# EAGLE design control-surface-left (EAGLE 6.6.0)
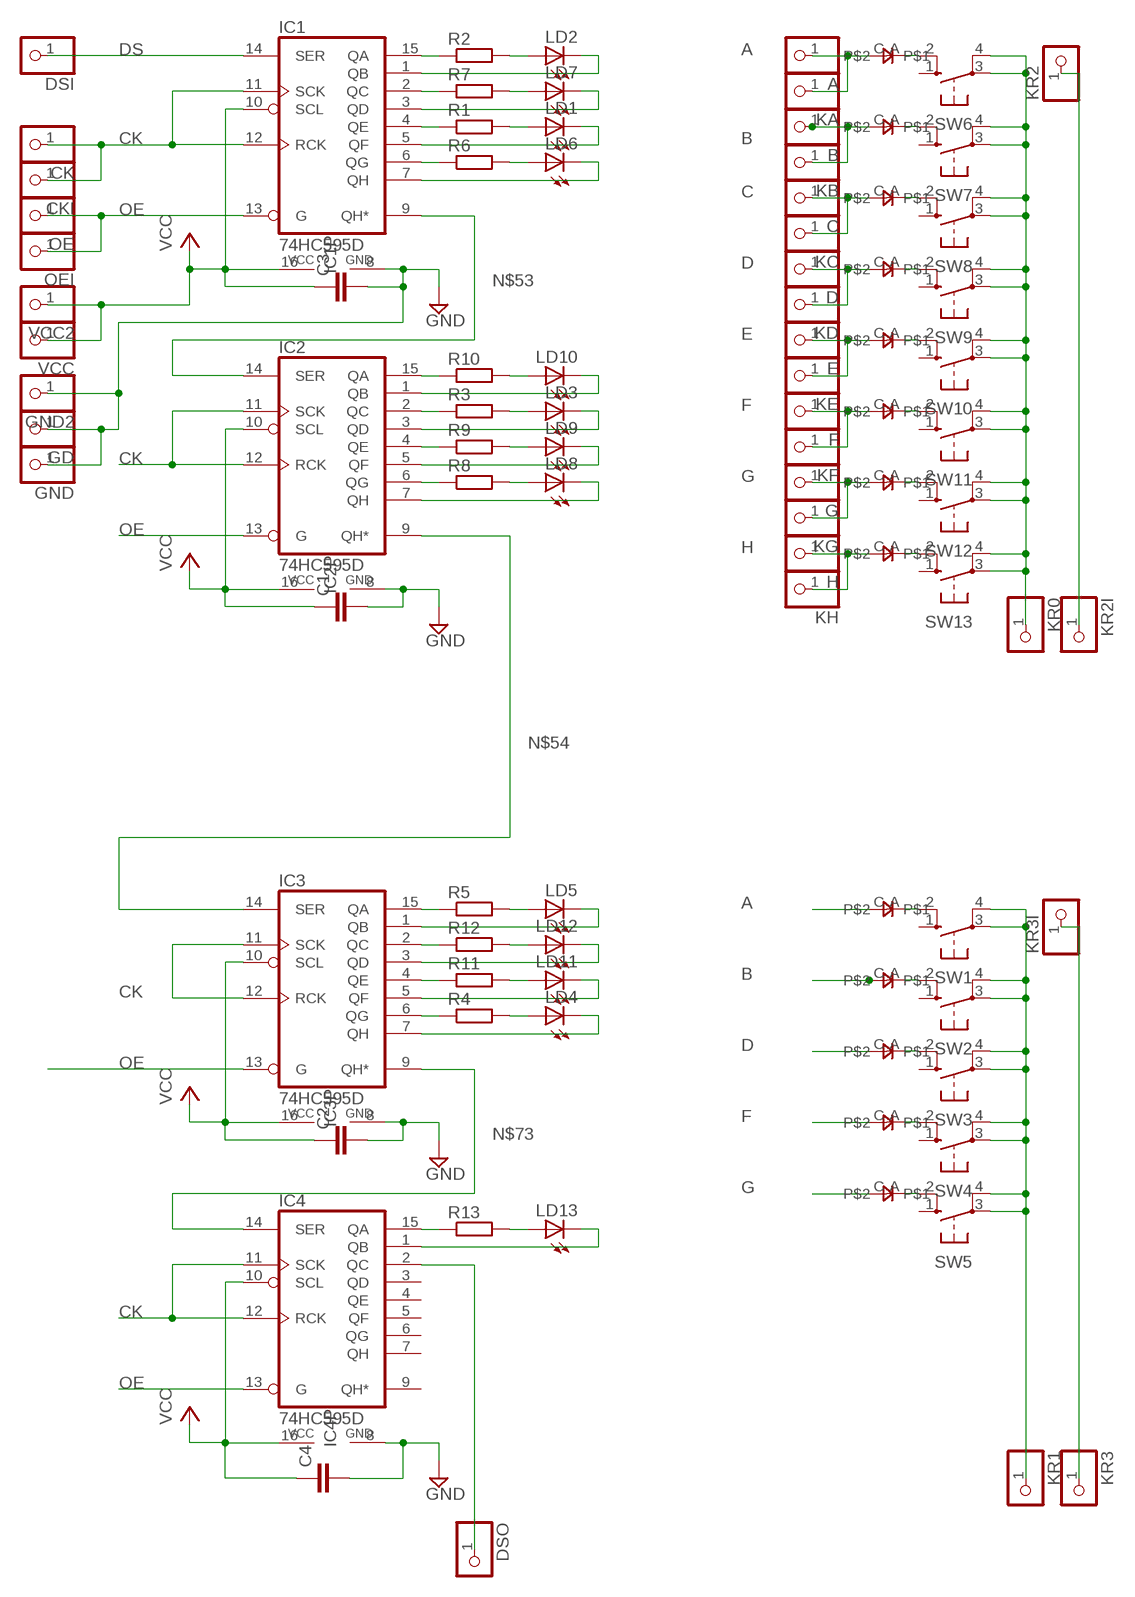
[diagram p0: schematic, sheet 1]

## Parts
A  PINHD-1X1  [1X01]
B  PINHD-1X1  [1X01]
C  PINHD-1X1  [1X01]
C1  C-EUC0805  [C0805]
C2  C-EUC0805  [C0805]
C3  C-EUC0805  [C0805]
C4  C-EUC0805  [C0805]
CK  PINHD-1X1  [1X01]
CKI  PINHD-1X1  [1X01]
D  PINHD-1X1  [1X01]
D1  0805DIODE  [0805DIODE]
D2  0805DIODE  [0805DIODE]
D3  0805DIODE  [0805DIODE]
D4  0805DIODE  [0805DIODE]
D5  0805DIODE  [0805DIODE]
D6  0805DIODE  [0805DIODE]
D7  0805DIODE  [0805DIODE]
D8  0805DIODE  [0805DIODE]
D9  0805DIODE  [0805DIODE]
D10  0805DIODE  [0805DIODE]
D11  0805DIODE  [0805DIODE]
D12  0805DIODE  [0805DIODE]
D13  0805DIODE  [0805DIODE]
DSI  PINHD-1X1  [1X01]
DSO  PINHD-1X1  [1X01]
E  PINHD-1X1  [1X01]
F  PINHD-1X1  [1X01]
G  PINHD-1X1  [1X01]
GD  PINHD-1X1  [1X01]
GND  PINHD-1X1  [1X01]
GND2  PINHD-1X1  [1X01]
H  PINHD-1X1  [1X01]
IC1  74HC595D  [SO16]
IC2  74HC595D  [SO16]
IC3  74HC595D  [SO16]
IC4  74HC595D  [SO16]
KA  PINHD-1X1  [1X01]
KB  PINHD-1X1  [1X01]
KC  PINHD-1X1  [1X01]
KD  PINHD-1X1  [1X01]
KE  PINHD-1X1  [1X01]
KF  PINHD-1X1  [1X01]
KG  PINHD-1X1  [1X01]
KH  PINHD-1X1  [1X01]
KR0  PINHD-1X1  [1X01]
KR1  PINHD-1X1  [1X01]
KR2  PINHD-1X1  [1X01]
KR2I  PINHD-1X1  [1X01]
KR3  PINHD-1X1  [1X01]
KR3I  PINHD-1X1  [1X01]
LD1  LED3MM  [LED3MM]
LD2  LED3MM  [LED3MM]
LD3  LED3MM  [LED3MM]
LD4  LED3MM  [LED3MM]
LD5  LED3MM  [LED3MM]
LD6  LED3MM  [LED3MM]
LD7  LED3MM  [LED3MM]
LD8  LED3MM  [LED3MM]
LD9  LED3MM  [LED3MM]
LD10  LED3MM  [LED3MM]
LD11  LED3MM  [LED3MM]
LD12  LED3MM  [LED3MM]
LD13  LED3MM  [LED3MM]
OE  PINHD-1X1  [1X01]
OEI  PINHD-1X1  [1X01]
R1  R-EU_R0805  [R0805]
R2  R-EU_R0805  [R0805]
R3  R-EU_R0805  [R0805]
R4  R-EU_R0805  [R0805]
R5  R-EU_R0805  [R0805]
R6  R-EU_R0805  [R0805]
R7  R-EU_R0805  [R0805]
R8  R-EU_R0805  [R0805]
R9  R-EU_R0805  [R0805]
R10  R-EU_R0805  [R0805]
R11  R-EU_R0805  [R0805]
R12  R-EU_R0805  [R0805]
R13  R-EU_R0805  [R0805]
SW1  40-XX  [B3F-40XX]
SW2  40-XX  [B3F-40XX]
SW3  40-XX  [B3F-40XX]
SW4  40-XX  [B3F-40XX]
SW5  40-XX  [B3F-40XX]
SW6  40-XX  [B3F-40XX]
SW7  40-XX  [B3F-40XX]
SW8  40-XX  [B3F-40XX]
SW9  40-XX  [B3F-40XX]
SW10  40-XX  [B3F-40XX]
SW11  40-XX  [B3F-40XX]
SW12  40-XX  [B3F-40XX]
SW13  40-XX  [B3F-40XX]
VCC  PINHD-1X1  [1X01]
VCC2  PINHD-1X1  [1X01]

## Nets
A: A.1 D1.C D6.C KA.1
B: B.1 D2.C D7.C KB.1
C: C.1 D8.C KC.1
CK: CK.1 CKI.1 IC1.11(SCK) IC1.12(RCK) IC2.11(SCK) IC2.12(RCK) IC3.11(SCK) IC3.12(RCK) IC4.11(SCK) IC4.12(RCK)
D: D3.C D9.C D.1 KD.1
DS: DSI.1 IC1.14(SER)
E: D10.C E.1 KE.1
F: D4.C D11.C F.1 KF.1
G: D5.C D12.C G.1 KG.1
GND: C1.2 C2.2 C3.2 C4.2 GD.1 GND2.1 GND.1 IC1.8(GND) IC2.8(GND) IC3.8(GND) IC4.8(GND)
H: D13.C H.1 KH.1
N$1: IC1.6(QG) R6.1
N$2: LD6.A R6.2
N$3: IC1.7(QH) LD6.K(C)
N$4: IC1.4(QE) R1.1
N$5: IC1.5(QF) LD1.K(C)
N$6: LD1.A R1.2
N$7: IC1.3(QD) LD7.K(C)
N$8: LD7.A R7.2
N$9: IC1.2(QC) R7.1
N$10: IC1.15(QA) R2.1
N$11: IC1.1(QB) LD2.K(C)
N$12: LD2.A R2.2
N$14: IC2.6(QG) R8.1
N$15: LD8.A R8.2
N$16: IC2.7(QH) LD8.K(C)
N$17: IC2.4(QE) R9.1
N$18: IC2.5(QF) LD9.K(C)
N$19: LD9.A R9.2
N$20: IC2.3(QD) LD3.K(C)
N$21: LD3.A R3.2
N$22: IC2.2(QC) R3.1
N$23: IC2.15(QA) R10.1
N$24: IC2.1(QB) LD10.K(C)
N$25: LD10.A R10.2
N$27: KR0.1 SW6.3(P) SW6.4(P1) SW7.3(P) SW7.4(P1) SW8.3(P) SW8.4(P1) SW9.3(P) SW9.4(P1) SW10.3(P) SW10.4(P1) SW11.3(P) SW11.4(P1) SW12.3(P) SW12.4(P1) SW13.3(P) SW13.4(P1)
N$28: D13.A SW13.2(S1)
N$29: D12.A SW12.2(S1)
N$30: D11.A SW11.2(S1)
N$31: D10.A SW10.2(S1)
N$32: D9.A SW9.2(S1)
N$33: D8.A SW8.2(S1)
N$34: D7.A SW7.2(S1)
N$35: D6.A SW6.2(S1)
N$44: KR2.1 KR2I.1
N$45: IC3.6(QG) R4.1
N$46: LD4.A R4.2
N$47: IC3.7(QH) LD4.K(C)
N$48: IC3.4(QE) R11.1
N$49: IC3.5(QF) LD11.K(C)
N$50: LD11.A R11.2
N$51: IC3.3(QD) LD12.K(C)
N$52: LD12.A R12.2
N$53: IC1.9(QH*) IC2.14(SER)
N$54: IC2.9(QH*) IC3.14(SER)
N$55: IC3.2(QC) R12.1
N$56: IC3.15(QA) R5.1
N$57: IC3.1(QB) LD5.K(C)
N$58: LD5.A R5.2
N$69: IC4.15(QA) R13.1
N$70: IC4.1(QB) LD13.K(C)
N$71: LD13.A R13.2
N$73: IC3.9(QH*) IC4.14(SER)
N$74: DSO.1 IC4.2(QC)
N$75: KR1.1 SW1.3(P) SW1.4(P1) SW2.3(P) SW2.4(P1) SW3.3(P) SW3.4(P1) SW4.3(P) SW4.4(P1) SW5.3(P) SW5.4(P1)
N$79: D5.A SW5.2(S1)
N$80: D4.A SW4.2(S1)
N$81: D3.A SW3.2(S1)
N$82: D2.A SW2.2(S1)
N$83: D1.A SW1.2(S1)
N$92: KR3.1 KR3I.1
OE: IC1.13(G) IC2.13(G) IC3.13(G) IC4.13(G) OE.1 OEI.1
VCC: C1.1 C2.1 C3.1 C4.1 IC1.10(SCL) IC1.16(VCC) IC2.10(SCL) IC2.16(VCC) IC3.10(SCL) IC3.16(VCC) IC4.10(SCL) IC4.16(VCC) VCC2.1 VCC.1
Unconnected: IC4.3(QD) IC4.4(QE) IC4.5(QF) IC4.6(QG) IC4.7(QH) IC4.9(QH*) SW1.1(S) SW2.1(S) SW3.1(S) SW4.1(S) SW5.1(S) SW6.1(S) SW7.1(S) SW8.1(S) SW9.1(S) SW10.1(S) SW11.1(S) SW12.1(S) SW13.1(S)

## Library data of the parts
A B C CK CKI D DSI DSO E F G GD GND GND2 H KA KB KC KD KE KF KG KH KR0 KR1 KR2 KR2I KR3 KR3I OE OEI VCC VCC2 = pinhead:PINHD-1X1: PIN HEADER
C1-C4 = rcl:C-EU: CAPACITOR, European symbol
D1-D13 = jasons_stuff:0805DIODE
IC1-IC4 = 74xx-eu:74*595: 8-bit SHIFT REGISTER, output latch
LD1-LD13 = led:LED: LED OSRAM: - CHIPLED LG R971, LG N971, LY N971, LG Q971, LY Q971, LO R971, LY R971 LH N974, LH R974 LS Q976, LO Q976, LY Q976 LO Q996 - Hyper CHIPLED LW Q18S LB Q993, LB Q99A, LB R99A - SideLED LS A670, LO A670, LY A670, LG A670, LP A670 LB A673, LV A673, LT A673, LW A673 LH A674 LY A675 LS A676, LA A676, LO A676, LY A676, LW A676 LS A679, LY A679, LG A679 - Hyper Micro SIDELED® LS Y876, LA Y876, LO Y876, LY Y876 LT Y87S - SmartLED LW L88C, LW L88S LB L89C, LB L89S, LG L890 LS L89K, LO L89K, LY L89K LS L896, LA L896, LO L896, LY L896 - TOPLED LS T670, LO T670, LY T670, LG T670, LP T670 LSG T670, LSP T670, LSY T670, LOP T670, LYG T670 LG T671, LOG T671, LSG T671 LB T673, LV T673, LT T673, LW T673 LH T674 LS T676, LA T676, LO T676, LY T676, LB T676, LH T676, LSB T676, LW T676 LB T67C, LV T67C, LT T67C, LS T67K, LO T67K, LY T67K, LW E67C LS E67B, LA E67B, LO E67B, LY E67B, LB E67C, LV E67C, LT E67C LW T67C LS T679, LY T679, LG T679 LS T770, LO T770, LY T770, LG T770, LP T770 LB T773, LV T773, LT T773, LW T773 LH T774 LS E675, LA E675, LY E675, LS T675 LS T776, LA T776, LO T776, LY T776, LB T776 LHGB T686 LT T68C, LB T68C - Hyper Mini TOPLED® LB M676 - Mini TOPLED Santana® LG M470 LS M47K, LO M47K, LY M47K Source: http://www.osram.convergy.de LUXEON: - LUMILED® LXK2-PW12-R00, LXK2-PW12-S00, LXK2-PW14-U00, LXK2-PW14-V00 LXK2-PM12-R00, LXK2-PM12-S00, LXK2-PM14-U00 LXK2-PE12-Q00, LXK2-PE12-R00, LXK2-PE12-S00, LXK2-PE14-T00, LXK2-PE14-U00 LXK2-PB12-K00, LXK2-PB12-L00, LXK2-PB12-M00, LXK2-PB14-N00, LXK2-PB14-P00, LXK2-PB14-Q00 LXK2-PR12-L00, LXK2-PR12-M00, LXK2-PR14-Q00, LXK2-PR14-R00 LXK2-PD12-Q00, LXK2-PD12-R00, LXK2-PD12-S00 LXK2-PH12-R00, LXK2-PH12-S00 LXK2-PL12-P00, LXK2-PL12-Q00, LXK2-PL12-R00 Source: www.luxeon.com KINGBRIGHT: KA-3528ASYC Source: www.kingbright.com
R1-R13 = rcl:R-EU_: RESISTOR, European symbol
SW1-SW13 = switch-omron:40-XX: OMRON SWITCH; MF: OMRON COMPONENTS USA; MPN: B3F-4000; OC_FARNELL: 176434; OC_NEWARK: 36K3105

## Board
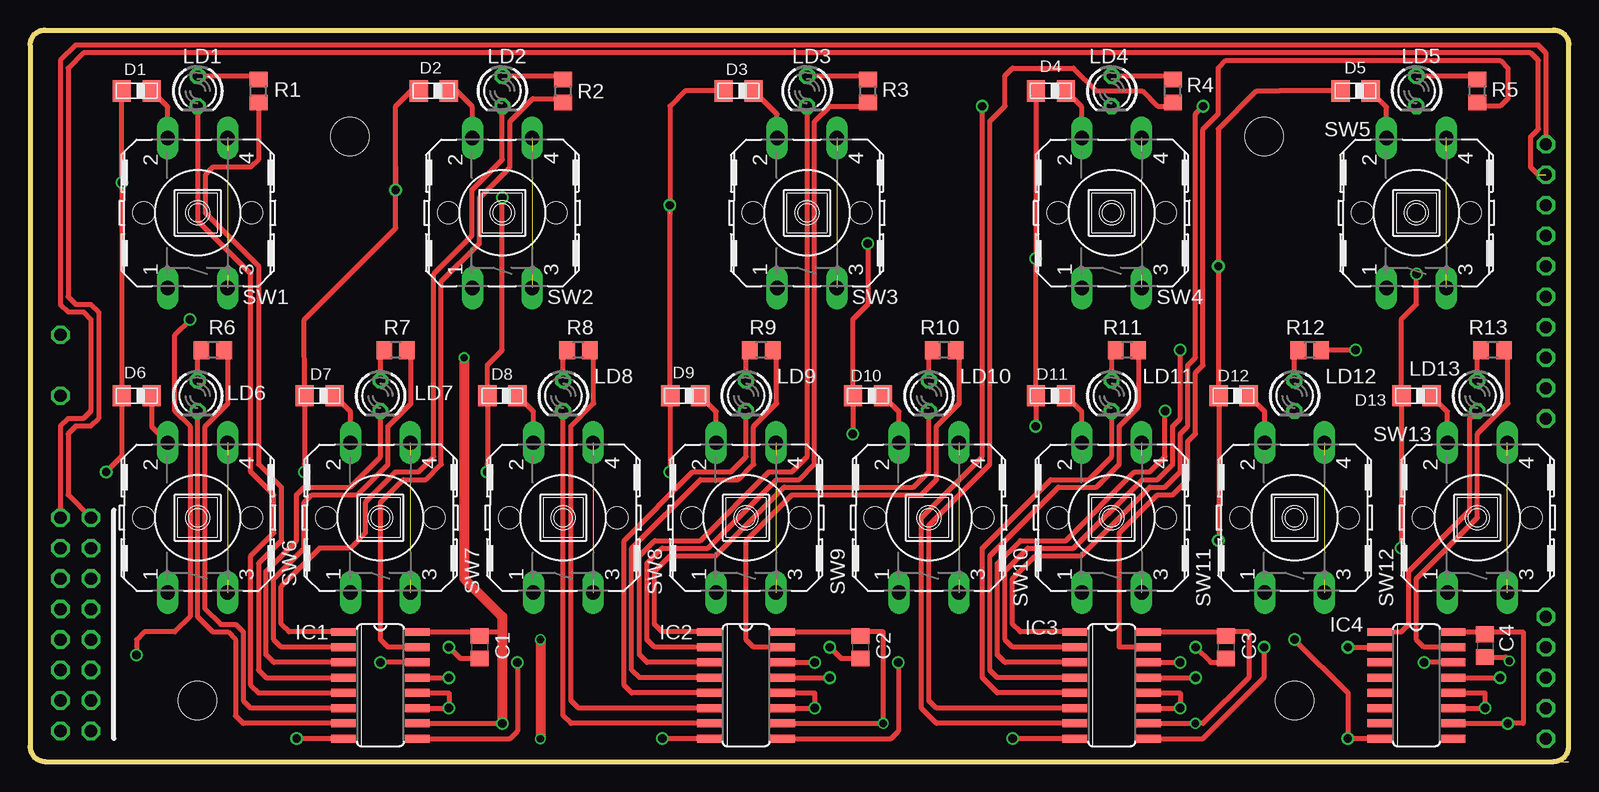
[diagram p1: board, top side]
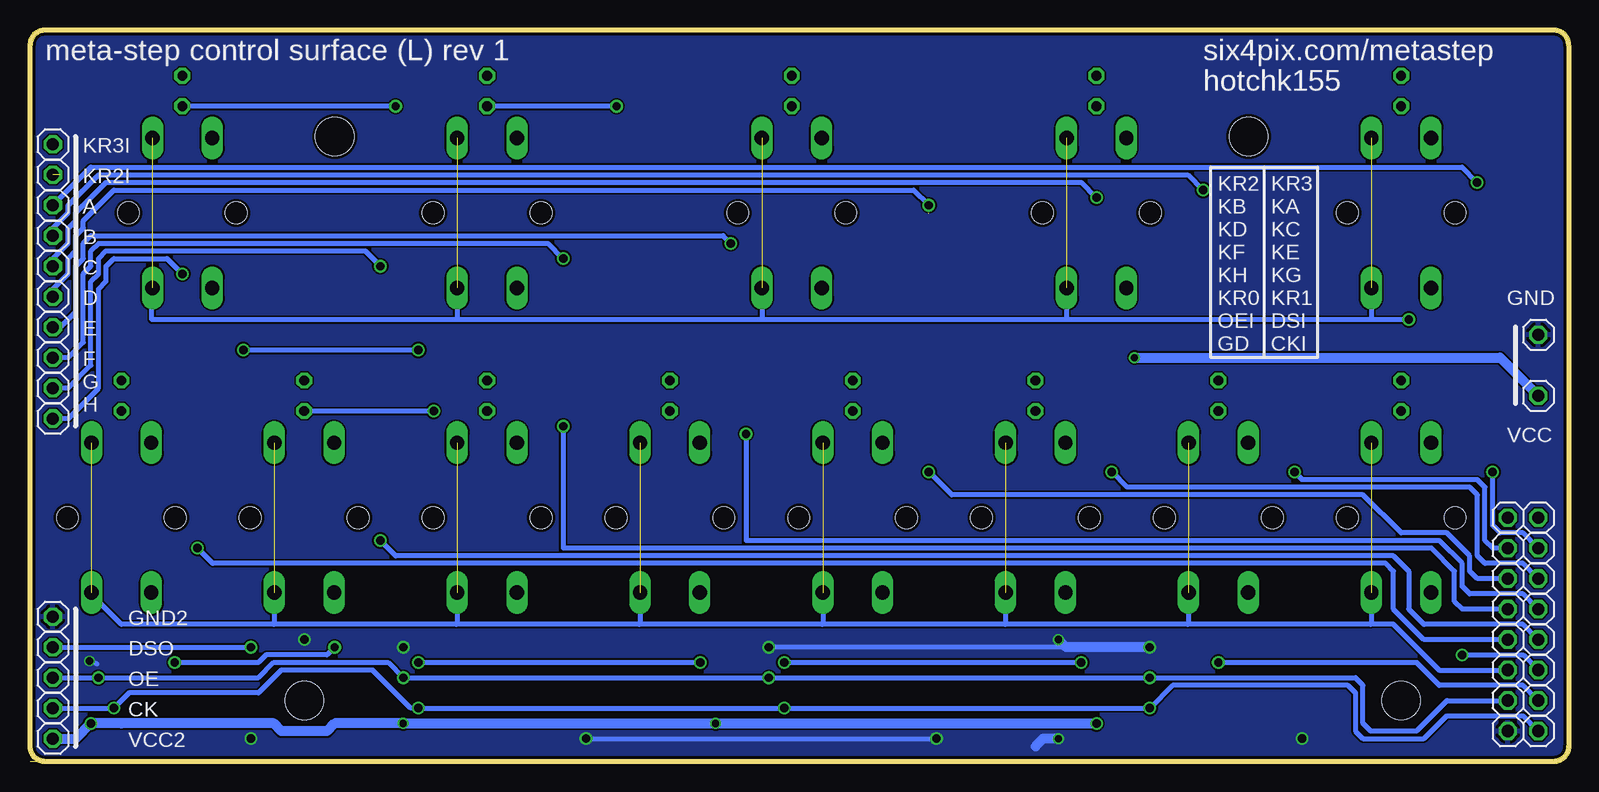
[diagram p2: board, bottom side, seen from below]

Size 128.27 x 60.96 mm. Coordinates in mm from the lower left corner, seen from the top.
Outline: 1.27,0 128.27,0
Outline: 1.27,0 127,0 arc90 128.27,1.27 128.27,59.69 arc90 127,60.96 1.27,60.96 arc90 0,59.69 0,1.27 arc90 1.27,0
Copper layers (1*16): Top 0.035mm / dielectric 1.5mm / Bottom 0.035mm
Design rules "ITEADstudio_DRC": minimum track width 6mil, minimum drill 12mil, track to track 6mil, track to pad 6mil, pad to pad 6mil, via to via 6mil, smd to smd 0mil, copper to edge 10mil, drill to drill 10mil, minimum pad ring 10mil, minimum via ring 6mil, stop-mask expansion 2mil, vias tented up to drill 100mil, thermal gap 10mil
Holes 3.2 mm at 26.67,52.07 102.87,52.07 13.97,5.08 105.41,5.08

### Footprints (pad centres in the part's own frame; a part is rotated, then mirrored left to right if it is on the bottom)
1X01 = drill 1.016 octagon: 1 0,0
C0805 = smd 1.3 x 1.5: 1 -0.95,0; 2 0.95,0
0805DIODE = smd 1.524 x 1.778: A -1.262,-0.005; C 1.238,-0.005
SO16 = smd 0.66 x 2.032: 1 -4.445,-3.073; 2 -3.175,-3.073; 3 -1.905,-3.073; 4 -0.635,-3.073; 5 0.635,-3.073; 6 1.905,-3.073; 7 3.175,-3.073; 8 4.445,-3.073; 9 4.445,3.073; 10 3.175,3.073; 11 1.905,3.073; 12 0.635,3.073; 13 -0.635,3.073; 14 -1.905,3.073; 15 -3.175,3.073; 16 -4.445,3.073
LED3MM = drill 0.813 octagon: A -1.27,0; K 1.27,0
R0805 = smd 1.3 x 1.5: 1 -0.95,0; 2 0.95,0
B3F-40XX = drill 1.194 long: 1 -6.248,2.489; 2 6.248,2.489; 3 -6.248,-2.489; 4 6.248,-2.489 | hole 1.803: 0,-4.496; 0,4.496

### Placement (x,y rotation side)
A  126.36,46.35 0 bottom
B  126.36,43.81 0 bottom
C  126.36,41.27 0 bottom
C1  37.47,9.53 270 top
C2  69.22,9.53 270 top
C3  99.69,9.53 270 top
C4  121.28,9.65 270 top
CK  126.36,4.45 0 bottom
CKI  2.54,2.54 0 bottom
D  126.36,38.73 0 bottom
D1  8.89,55.88 180 top
D2  33.66,55.88 180 top
D3  59.05,55.88 180 top
D4  85.09,55.88 180 top
D5  110.49,55.88 180 top
D6  8.89,30.48 180 top
D7  24.13,30.48 180 top
D8  39.37,30.48 180 top
D9  54.61,30.48 180 top
D10  69.85,30.48 180 top
D11  85.09,30.48 180 top
D12  100.33,30.48 180 top
D13  115.57,30.48 180 top
DSI  2.54,5.08 0 bottom
DSO  126.36,9.53 0 bottom
E  126.36,36.2 0 bottom
F  126.36,33.66 0 bottom
G  126.36,31.11 0 bottom
GD  5.08,2.54 0 bottom
GND  2.54,35.56 0 bottom
GND2  126.36,12.06 0 bottom
H  126.36,28.57 0 bottom
IC1  29.21,6.35 270 top
IC2  59.69,6.35 270 top
IC3  90.17,6.35 270 top
IC4  115.57,6.35 270 top
KA  2.54,17.78 0 bottom
KB  5.08,17.78 0 bottom
KC  2.54,15.24 0 bottom
KD  5.08,15.24 0 bottom
KE  2.54,12.7 0 bottom
KF  5.08,12.7 0 bottom
KG  2.54,10.16 0 bottom
KH  5.08,10.16 0 bottom
KR0  5.08,7.62 0 bottom
KR1  2.54,7.62 0 bottom
KR2  5.08,20.32 0 bottom
KR2I  126.36,48.9 0 bottom
KR3  2.54,20.32 0 bottom
KR3I  126.36,51.44 0 bottom
LD1  13.97,55.88 270 top
LD2  39.37,55.88 270 top
LD3  64.77,55.88 270 top
LD4  90.17,55.88 270 top
LD5  115.57,55.88 270 top
LD6  13.97,30.48 270 top
LD7  29.21,30.48 270 top
LD8  44.45,30.48 270 top
LD9  59.69,30.48 270 top
LD10  74.93,30.48 270 top
LD11  90.17,30.48 270 top
LD12  105.41,30.48 270 top
LD13  120.65,30.48 270 top
OE  126.36,6.99 0 bottom
OEI  5.08,5.08 0 bottom
R1  19.05,55.88 90 top
R2  44.45,55.88 90 top
R3  69.85,55.88 90 top
R4  95.25,55.88 90 top
R5  120.65,55.88 90 top
R6  15.24,34.29 180 top
R7  30.48,34.29 180 top
R8  45.72,34.29 180 top
R9  60.96,34.29 180 top
R10  76.2,34.29 180 top
R11  91.44,34.29 180 top
R12  106.68,34.29 180 top
R13  121.92,34.29 180 top
SW1  13.97,45.72 90 top
SW2  39.37,45.72 90 top
SW3  64.77,45.72 90 top
SW4  90.17,45.72 90 top
SW5  115.57,45.72 90 top
SW6  13.97,20.32 90 top
SW7  29.21,20.32 90 top
SW8  44.45,20.32 90 top
SW9  59.69,20.32 90 top
SW10  74.93,20.32 90 top
SW11  90.17,20.32 90 top
SW12  105.41,20.32 90 top
SW13  120.65,20.32 90 top
VCC  2.54,30.48 0 bottom
VCC2  126.36,1.91 0 bottom

### Tracks (layer width: path | path; a pad name or v marks a point on that pad's centre or on a via)
A  (via drill 0.7)
  Top 0.406: v6.35,24.13 7.65,25.43 D6.C v7.65,48.26 D1.C
  Bottom 0.406: v6.35,24.13 6.35,19.68 5.71,19.05 3.81,19.05 KA.1 | v7.65,48.26 7.65,48.29 8.89,49.53 123.19,49.53 A.1
B  (via drill 0.7)
  Top 0.406: 30.48,49.52 v30.48,47.62 | v30.48,47.62 30.48,44.45 22.87,36.84 D7.C 22.89,24.8 v22.86,24.13 | v30.48,47.62 30.48,54.61 31.75,55.88 D2.C
  Bottom 0.406: v30.48,47.62 31.75,48.9 122.56,48.9 125.09,46.35 125.09,45.72 126.36,44.45 B.1 | v22.86,24.13 22.23,23.5 7.62,23.5 6.98,22.86 6.98,18.41 6.35,17.78 KB.1
C  (via drill 0.7)
  Top 0.406: v38.1,24.13 38.13,24.8 D8.C 38.13,33.05 39.37,34.29 v39.37,46.99
  Bottom 0.406: v38.1,24.13 36.83,22.86 8.25,22.86 7.62,22.23 7.62,17.14 6.98,16.51 3.81,16.51 KC.1 | v39.37,46.99 40.64,48.26 121.92,48.26 124.46,45.72 124.46,45.09 125.09,44.45 125.09,43.18 126.36,41.91 C.1
CK  (via drill 0.7)
  Top 0.406: IC4.11 v121.28,4.45 121.28,5.71 IC4.12 | IC1.11 v34.92,4.45 34.92,5.71 IC1.12 | IC2.11 v65.41,4.45 65.41,5.71 IC2.12 | IC3.11 v95.88,4.45 95.88,5.71 IC3.12
  Bottom 0.406: CKI.1 3.81,3.81 10.16,3.81 12.07,1.91 17.14,1.91 17.78,2.54 17.78,5.71 18.41,6.35 33.02,6.35 v34.92,4.45 v65.41,4.45 v95.88,4.45 96.52,4.45 99.69,7.62 107.31,7.62 109.22,5.71 120.01,5.71 v121.28,4.45 CK.1
D  (via drill 0.7)  (1 unrouted)
  Top 0.406: v53.34,46.35 53.37,45.69 D9.C 53.37,24.16 v53.34,24.13 | D3.C 54.62,55.88 53.34,54.61 53.34,45.72
  Bottom 0.406: v53.34,46.35 54.61,47.62 121.28,47.62 123.82,45.09 123.82,44.45 124.46,43.81 124.46,42.55 125.09,41.91 125.09,40.64 126.36,39.37 D.1 | v53.34,24.13 51.44,22.23 17.14,22.23 13.97,19.05 10.16,19.05 8.25,17.14 8.25,15.88 7.62,15.24 KD.1
DS  (via drill 0.7)
  Top 0.406: IC1.14 v29.21,8.26
  Bottom 0.406: v29.21,8.26 12.7,8.26 10.8,6.35 3.81,6.35 DSI.1
E  (via drill 0.7)
  Top 0.406: v68.58,27.3 68.61,27.97 D10.C 68.61,31.72 68.58,31.75 68.58,36.83 69.85,38.1 v69.85,43.18
  Bottom 0.406: v68.58,27.3 68.58,18.41 10.8,18.41 8.89,16.51 8.89,14.61 8.25,13.97 3.81,13.97 KE.1 | v69.85,43.18 70.49,43.81 123.19,43.81 123.82,43.18 123.82,41.91 124.46,41.27 124.46,37.47 125.73,36.2 E.1
F  (via drill 0.7)
  Top 0.406: D4.C 83.85,41.94 v83.82,41.91 83.82,30.52 D11.C 83.85,27.97 v83.82,27.94
  Bottom 0.406: v83.82,41.91 85.09,43.18 122.56,43.18 123.19,42.55 123.19,41.27 123.82,40.64 123.82,34.92 125.09,33.66 F.1 | v83.82,27.94 83.82,17.78 11.43,17.78 9.52,15.88 9.52,13.34 8.89,12.7 KF.1
G  (via drill 0.7)
  Top 0.406: D5.C 104.15,55.88 104.14,55.88 102.24,55.88 99.06,52.7 v99.06,41.27 99.06,30.52 D12.C 99.09,18.45 v99.06,18.41
  Bottom 0.406: v99.06,41.27 100.33,42.55 121.92,42.55 122.56,41.91 122.56,40.64 123.19,40.01 123.19,33.02 125.09,31.11 G.1 | v99.06,18.41 97.79,17.14 14.61,17.14 13.34,15.88 13.34,12.7 12.07,11.43 3.81,11.43 KG.1
GND  (via drill 0.6, 0.7)
  Top 0.406: IC1.8 v22.23,1.91 | IC2.8 v52.71,1.91 | IC3.8 v81.91,1.91 | IC4.8 v109.85,1.91 109.85,5.71 v105.41,10.16 | 99.38,8.26 98.43,8.26 v97.16,9.53 | 99.38,8.26 C3.2 99.69,8.26 99.38,8.26 | C2.2 67.62,8.57 v66.68,9.53 | C1.2 35.88,8.57 v34.92,9.53 | C4.2 123,8.7 v123.32,8.38
  Top 0.813: v42.55,10.16 v42.55,1.91
  Bottom 0.406: v81.91,1.91 v52.71,1.91 | v34.92,9.53 v66.68,9.53 | v123.32,8.38 122.68,8.13
  Bottom 0.813: v34.92,9.53 41.91,9.53 v42.55,10.16 | v42.55,1.91 43.81,1.91 44.45,1.27
  pour Bottom: -7.62,63.5 -7.62,-2.54 134.62,-2.54 134.62,67.31 -7.62,67.31
H  (via drill 0.7)
  Top 0.406: v115.57,40.64 115.57,38.1 114.33,36.86 D13.C 114.33,17.81 v114.3,17.78
  Bottom 0.406: v115.57,40.64 116.84,41.91 121.28,41.91 121.92,41.27 121.92,40.01 122.56,39.37 122.56,31.11 125.09,28.57 H.1 | v114.3,17.78 113.03,16.51 15.24,16.51 14.61,15.88 14.61,12.7 12.07,10.16 KH.1
N$1
  Top 0.406: IC1.6 18.41,4.45 17.78,5.08 17.78,10.79 17.14,11.43 15.88,11.43 14.61,12.7 14.61,27.94 16.51,29.84 16.51,33.97 R6.1
N$2
  Top 0.406: LD6.A 13.97,33.97 R6.2
N$3
  Top 0.406: IC1.7 17.78,3.17 17.14,3.81 17.14,10.16 16.51,10.79 15.24,10.79 13.97,12.06 LD6.K
N$4
  Top 0.406: IC1.4 19.68,6.99 19.05,7.62 19.05,16.51 20.95,18.41 20.95,22.86 19.05,24.77 19.05,41.27 14.61,45.72 14.61,48.9 15.24,49.53 18.41,49.53 19.05,50.16 R1.1
N$5
  Top 0.406: LD1.K 13.97,45.09 18.41,40.64 18.41,24.13 20.32,22.23 20.32,19.05 18.41,17.14 18.41,6.35 19.05,5.71 IC1.5
N$6
  Top 0.406: LD1.A 18.73,57.15 R1.2
N$7
  Top 0.406: IC1.3 20.32,8.26 19.68,8.89 19.68,15.88 22.23,18.41 22.23,22.23 22.86,22.86 26.67,22.86 29.21,25.4 LD7.K
N$8
  Top 0.406: LD7.A 29.21,34.29 R7.2
N$9
  Top 0.406: IC1.2 20.95,9.53 20.32,10.16 20.32,15.24 22.86,17.78 22.86,21.59 23.49,22.23 27.3,22.23 29.84,24.77 29.84,27.94 31.75,29.84 31.75,33.97 R7.1
N$10
  Top 0.406: IC1.15 29.84,9.53 29.21,10.16 29.21,21.59 31.12,23.5 33.02,23.5 34.29,24.77 34.29,40.01 37.47,43.18 37.47,46.99 40.01,49.53 40.01,53.34 41.91,55.24 44.13,55.24 R2.1
N$11
  Top 0.406: IC1.1 21.59,10.79 20.95,11.43 20.95,14.61 24.13,17.78 26.67,17.78 27.94,19.05 27.94,21.59 30.48,24.13 32.38,24.13 33.66,25.4 33.66,40.64 36.83,43.81 36.83,47.62 39.37,50.16 LD2.K
N$12
  Top 0.406: LD2.A 44.45,57.15 R2.2
N$14
  Top 0.406: IC2.6 45.72,4.45 45.09,5.08 45.09,27.94 46.99,29.84 46.99,33.97 R8.1
N$15
  Top 0.406: LD8.A 44.45,33.97 R8.2
N$16
  Top 0.406: IC2.7 45.09,3.17 44.45,3.81 LD8.K
N$17
  Top 0.406: IC2.4 50.8,6.99 50.16,7.62 50.16,17.78 55.88,23.5 59.05,23.5 60.32,24.77 60.32,27.94 62.23,29.84 62.23,33.97 R9.1
N$18
  Top 0.406: IC2.5 50.16,5.71 49.53,6.35 49.53,18.41 55.24,24.13 58.42,24.13 59.69,25.4 LD9.K
N$19
  Top 0.406: LD9.A 59.69,33.97 R9.2
N$20
  Top 0.406: IC2.3 51.44,8.26 50.8,8.89 50.8,17.14 52.07,18.41 55.88,18.41 61.6,24.13 63.5,24.13 64.77,25.4 LD3.K
N$21
  Top 0.406: LD3.A 69.53,57.15 R3.2
N$22
  Top 0.406: IC2.2 52.07,9.53 51.44,10.16 51.44,16.51 52.71,17.78 56.51,17.78 62.23,23.5 64.13,23.5 65.41,24.77 65.41,53.34 66.68,54.61 69.53,54.61 R3.1
N$23
  Top 0.406: IC2.15 60.32,9.53 59.69,10.16 59.69,18.41 63.5,22.23 74.29,22.23 75.56,23.5 75.56,27.94 77.47,29.84 77.47,33.97 R10.1
N$24
  Top 0.406: IC2.1 52.71,10.79 52.07,11.43 52.07,15.88 53.34,17.14 57.15,17.14 62.87,22.86 73.66,22.86 74.93,24.13 LD10.K
N$25
  Top 0.406: LD10.A 74.93,33.97 R10.2
N$27  (8 unrouted)
  Bottom 0.406: SW6.3 16.46,11.48 | 16.46,11.48 16.51,11.43 31.75,11.43 | 31.75,11.43 46.99,11.43 | 46.99,11.43 62.23,11.43 | 62.23,11.43 77.47,11.43 | 77.47,11.43 92.71,11.43 | 92.71,11.43 107.95,11.43 | 107.95,11.43 120.65,11.43 123.19,13.97 123.19,14.02 SW13.3 | SW12.3 107.9,11.48 107.95,11.43 | SW11.3 92.66,11.48 92.71,11.43 | SW10.3 77.42,11.48 77.47,11.43 | SW9.3 62.18,11.48 62.23,11.43 | SW8.3 46.94,11.48 46.99,11.43 | SW7.3 31.7,11.48 31.75,11.43 | 16.46,11.48 14.66,11.48 10.8,7.62 KR0.1
N$28
  Top 0.406: SW13.2 118.16,29.16 D13.A
N$29
  Top 0.406: SW12.2 102.92,29.16 D12.A
N$30
  Top 0.406: SW11.2 87.68,29.16 D11.A
N$31
  Top 0.406: SW10.2 72.44,29.16 D10.A
N$32
  Top 0.406: SW9.2 57.2,29.16 D9.A
N$33
  Top 0.406: SW8.2 41.96,29.16 D8.A
N$34
  Top 0.406: SW7.2 26.72,29.16 D7.A
N$35
  Top 0.406: D6.A 10.15,27.9 SW6.2
N$44  (1 unrouted)
  Top 0.406: 125.73,48.9 125.09,49.53 125.09,52.07 125.73,52.7 125.73,58.42 125.09,59.05 4.45,59.05 3.18,57.78 3.18,38.73 3.81,38.1 5.08,38.1 5.71,37.47 5.71,28.57 5.08,27.94 3.81,27.94 3.18,27.3 3.18,22.23 KR2.1
N$45
  Top 0.406: IC3.6 75.56,4.45 74.93,5.08 74.93,19.68 80.01,24.77 80.01,53.34 81.28,54.61 81.28,57.15 81.91,57.78 87,57.78 88.9,55.88 92.71,55.88 93.98,54.61 94.93,54.61 R4.1
N$46
  Top 0.406: LD4.A 94.93,57.15 R4.2
N$47  (via drill 0.7)
  Top 0.406: IC3.7 75.56,3.17 74.29,4.45 74.29,20.32 79.38,25.4 v79.38,54.61
  Bottom 0.406: v79.38,54.61 LD4.K
N$48
  Top 0.406: IC3.4 80.65,6.99 80.01,7.62 80.01,17.14 85.72,22.86 88.9,22.86 90.81,24.77 90.81,27.94 92.39,29.52 R11.1
N$49
  Top 0.406: IC3.5 80.65,5.71 79.38,6.99 79.38,17.78 85.09,23.5 88.26,23.5 90.17,25.4 LD11.K
N$50
  Top 0.406: LD11.A 90.17,33.97 R11.2
N$51  (via drill 0.7)
  Top 0.406: IC3.3 81.28,8.26 80.65,8.89 80.65,16.51 82.55,18.41 86.36,18.41 92.07,24.13 93.34,24.13 94.62,25.4 v94.62,29.21
  Bottom 0.406: v94.62,29.21 LD12.K
N$52
  Top 0.406: LD12.A 105.41,33.97 R12.2
N$53  (via drill 0.7)
  Top 0.406: IC1.9 40.01,1.91 40.64,2.54 v40.64,8.26 | IC2.14 v65.41,8.26
  Bottom 0.406: v65.41,8.26 v40.64,8.26
N$54  (via drill 0.7)
  Top 0.406: IC2.9 71.75,1.91 72.39,2.54 v72.39,8.26 | IC3.14 v95.88,8.26
  Bottom 0.406: v95.88,8.26 v72.39,8.26
N$55  (via drill 0.7)
  Top 0.406: IC3.2 81.91,9.53 81.28,10.16 81.28,15.88 83.19,17.78 87,17.78 92.71,23.5 93.98,23.5 95.25,24.77 95.25,27.94 95.88,28.57 v95.88,34.29 | v110.49,34.29 R12.1
  Bottom 0.406: v95.88,34.29 v110.49,34.29
N$56
  Top 0.406: IC3.15 90.81,9.53 90.81,19.05 93.98,22.23 95.25,22.23 96.52,23.5 96.52,26.67 97.16,27.3 97.16,32.38 97.79,33.02 97.79,52.7 99.06,53.98 99.06,57.78 99.69,58.42 122.56,58.42 123.19,57.78 123.19,55.24 122.56,54.61 120.65,54.61 R5.1
N$57  (via drill 0.7)
  Top 0.406: IC3.1 82.55,10.79 81.91,11.43 81.91,15.24 83.82,17.14 87.63,17.14 93.34,22.86 94.62,22.86 95.88,24.13 95.88,27.3 96.52,27.94 96.52,33.02 97.16,33.66 97.16,53.98 v97.79,54.61
  Bottom 0.406: v97.79,54.61 LD5.K
N$58
  Top 0.406: LD5.A 120.33,57.15 R5.2
N$69
  Top 0.406: IC4.15 116.21,9.53 115.57,10.16 115.57,15.24 120.65,20.32 120.65,27.3 123.19,29.84 123.19,33.97 R13.1
N$70
  Top 0.406: IC4.1 114.3,10.79 114.94,11.43 114.94,15.88 120.01,20.95 120.01,28.57 LD13.K
N$71
  Top 0.406: LD13.A 120.65,33.97 R13.2
N$73  (via drill 0.7)
  Top 0.406: IC3.9 97.79,1.91 102.87,6.99 v102.87,9.53 | IC4.14 v116.21,8.26
  Bottom 0.406: v116.21,8.26 109.22,8.26 108.59,8.89 103.5,8.89 v102.87,9.53
N$74  (via drill 0.7)
  Top 0.406: v109.85,9.53 IC4.2
  Bottom 0.406: DSO.1 v109.85,9.53
N$75  (via drill 0.7)  (5 unrouted)
  Top 0.406: v13.34,36.83 12.07,35.56 12.07,29.21 13.34,27.94 13.34,12.06 12.07,10.79 9.52,10.79 8.89,10.16 v8.89,8.89
  Bottom 0.406: SW1.3 16.46,36.88 16.51,36.83 | 16.51,36.83 41.91,36.83 | 41.91,36.83 67.31,36.83 | 67.31,36.83 92.71,36.83 | 92.71,36.83 118.11,36.83 118.11,39.42 SW5.3 | SW4.3 92.66,36.88 92.71,36.83 | SW3.3 67.26,36.88 67.31,36.83 | SW2.3 41.86,36.88 41.91,36.83 | v13.34,36.83 16.51,36.83 | v8.89,8.89 3.81,8.89 KR1.1
N$79
  Top 0.406: SW5.2 113.08,54.56 D5.A
N$80
  Top 0.406: SW4.2 87.68,54.56 D4.A
N$81
  Top 0.406: SW3.2 62.28,53.92 D3.A
N$82
  Top 0.406: SW2.2 36.88,54.56 35.56,55.88 D2.A
N$83
  Top 0.406: SW1.2 11.48,54.56 D1.A
N$92
  Top 0.406: KR3.1 2.54,27.94 3.18,28.57 4.45,28.57 5.08,29.21 5.08,36.83 4.45,37.47 3.18,37.47 2.54,38.1 2.54,58.42 3.81,59.69 125.73,59.69 126.36,59.05 KR3I.1
OE  (via drill 0.7)
  Top 0.406: IC4.13 v122.56,6.99 | IC3.13 v97.16,6.99 | IC2.13 v66.68,6.99 | IC1.13 v34.92,6.99
  Bottom 0.406: OEI.1 10.16,5.08 12.7,2.54 16.51,2.54 17.14,3.17 17.14,6.35 17.78,6.99 v34.92,6.99 v66.68,6.99 v97.16,6.99 98.43,8.26 107.95,8.26 109.22,6.99 v122.56,6.99 OE.1
VCC  (via drill 0.6, 0.7)
  Top 0.406: IC3.16 99.38,10.79 | 99.38,10.79 C3.1 | IC2.16 68.9,10.79 C2.1 69.53,10.79 71.12,10.79 v71.12,3.17 IC2.10 | IC1.16 37.15,10.79 C1.1 37.79,10.79 39.37,10.79 | IC4.10 v123.19,3.17 124.46,3.17 124.46,10.79 121.92,10.79 | 99.38,10.79 101.6,10.79 101.6,6.99 97.79,3.17 v97.16,3.17 IC3.10 | IC1.10 v39.37,3.17 | IC4.16 121.92,10.79 | C4.1 121.73,10.6 121.92,10.79
  Top 0.813: v36.2,33.66 36.2,15.24 39.37,12.06 39.37,10.79 v39.37,3.17
  Bottom 0.813: v39.37,3.17 v71.12,3.17 v97.16,3.17 102.87,3.17 103.5,2.54 107.31,2.54 107.95,3.17 v123.19,3.17 | v36.2,33.66 5.71,33.66 VCC.1 | v123.19,3.17 124.46,1.91 VCC2.1 | 120.65,3.17 v123.19,3.17

### Text on the board
bNames: six4pix.com/metastep | meta-step control surface (L) rev 1 | hotchk155